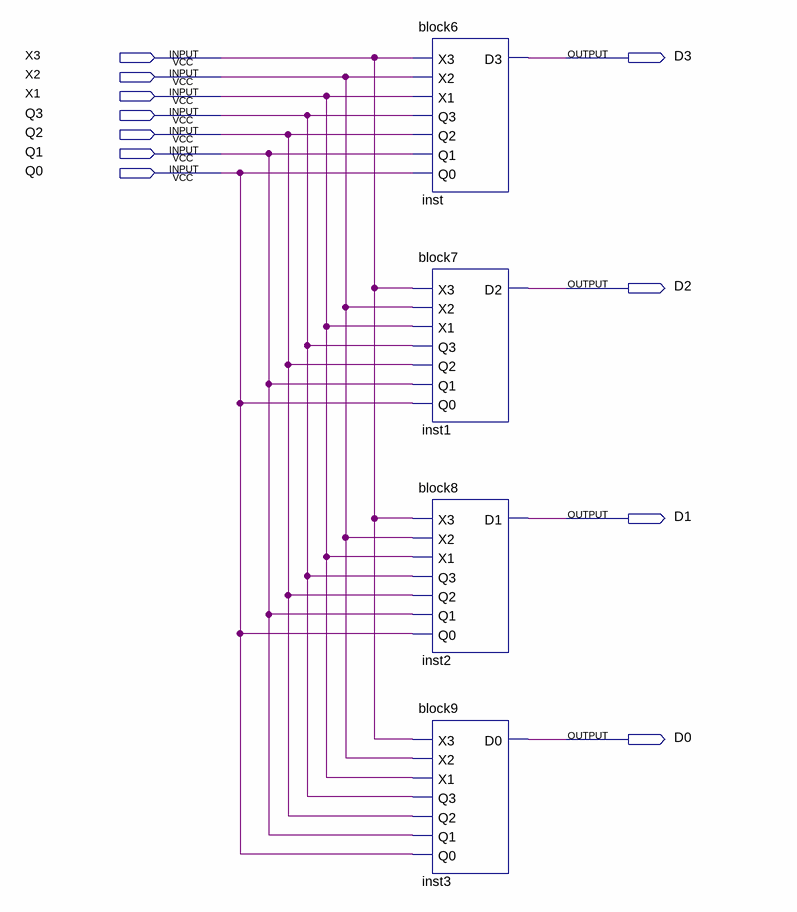
[diagram p0: schematic sheet]
// Quartus schematic block10.bdf as structural Verilog: 4 symbols, 11 pins
module block10 (
  input  X3,
  input  X2,
  input  X1,
  input  Q3,
  input  Q2,
  input  Q1,
  input  Q0,
  output D3,
  output D2,
  output D1,
  output D0
);

  block6 inst (.X3(X3), .X2(X2), .X1(X1), .Q3(Q3), .Q2(Q2), .Q1(Q1), .Q0(Q0), .D3(D3));
  block7 inst1 (.X3(X3), .X2(X2), .X1(X1), .Q3(Q3), .Q2(Q2), .Q1(Q1), .Q0(Q0), .D2(D2));
  block8 inst2 (.X3(X3), .X2(X2), .X1(X1), .Q3(Q3), .Q2(Q2), .Q1(Q1), .Q0(Q0), .D1(D1));
  block9 inst3 (.X3(X3), .X2(X2), .X1(X1), .Q3(Q3), .Q2(Q2), .Q1(Q1), .Q0(Q0), .D0(D0));
endmodule
